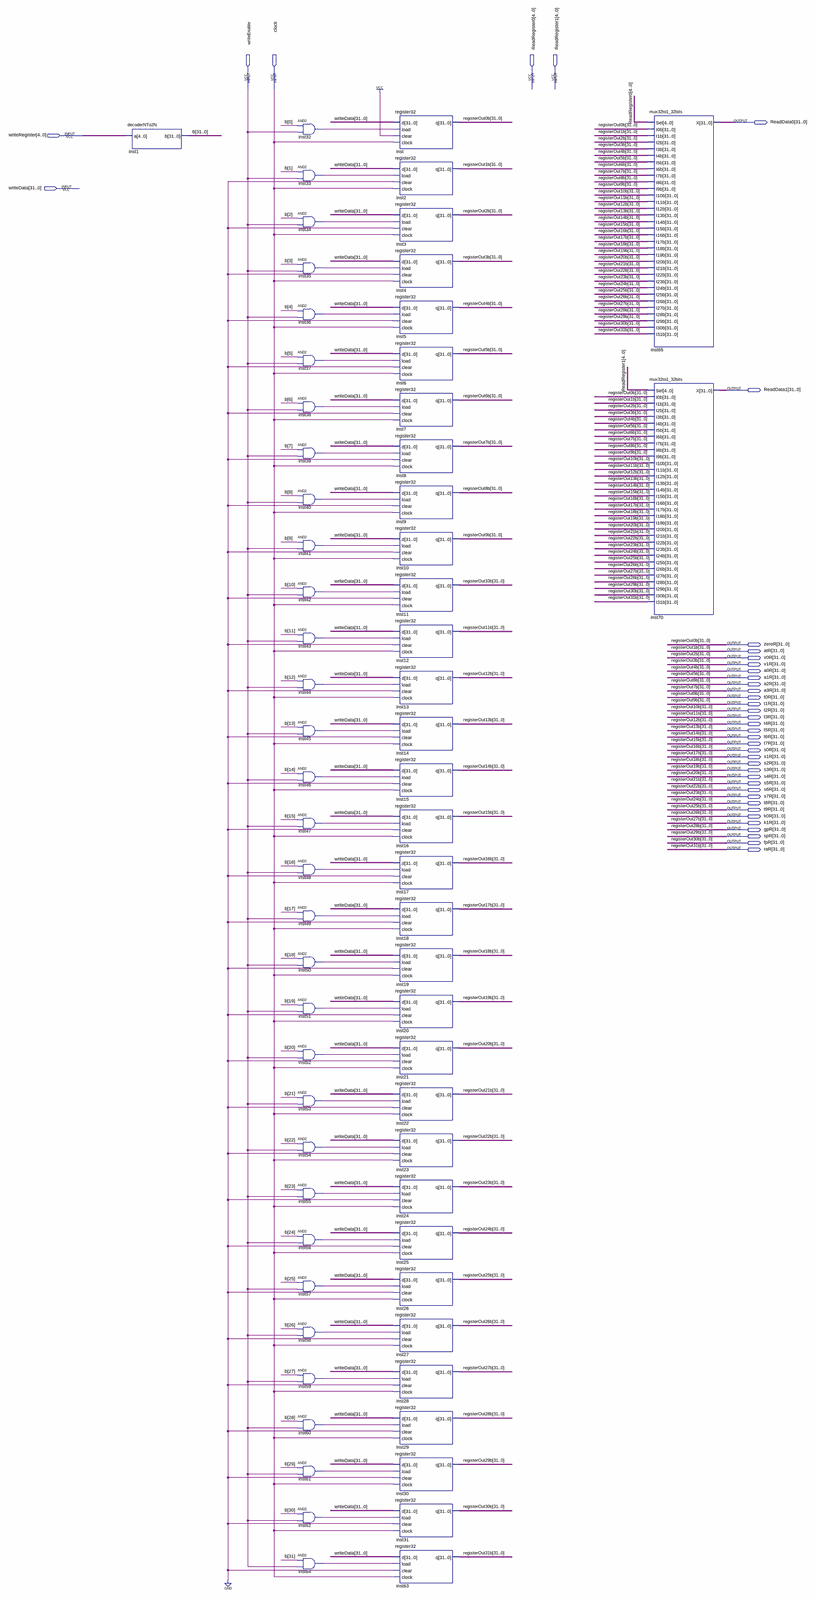
[diagram p0: schematic sheet, whole]
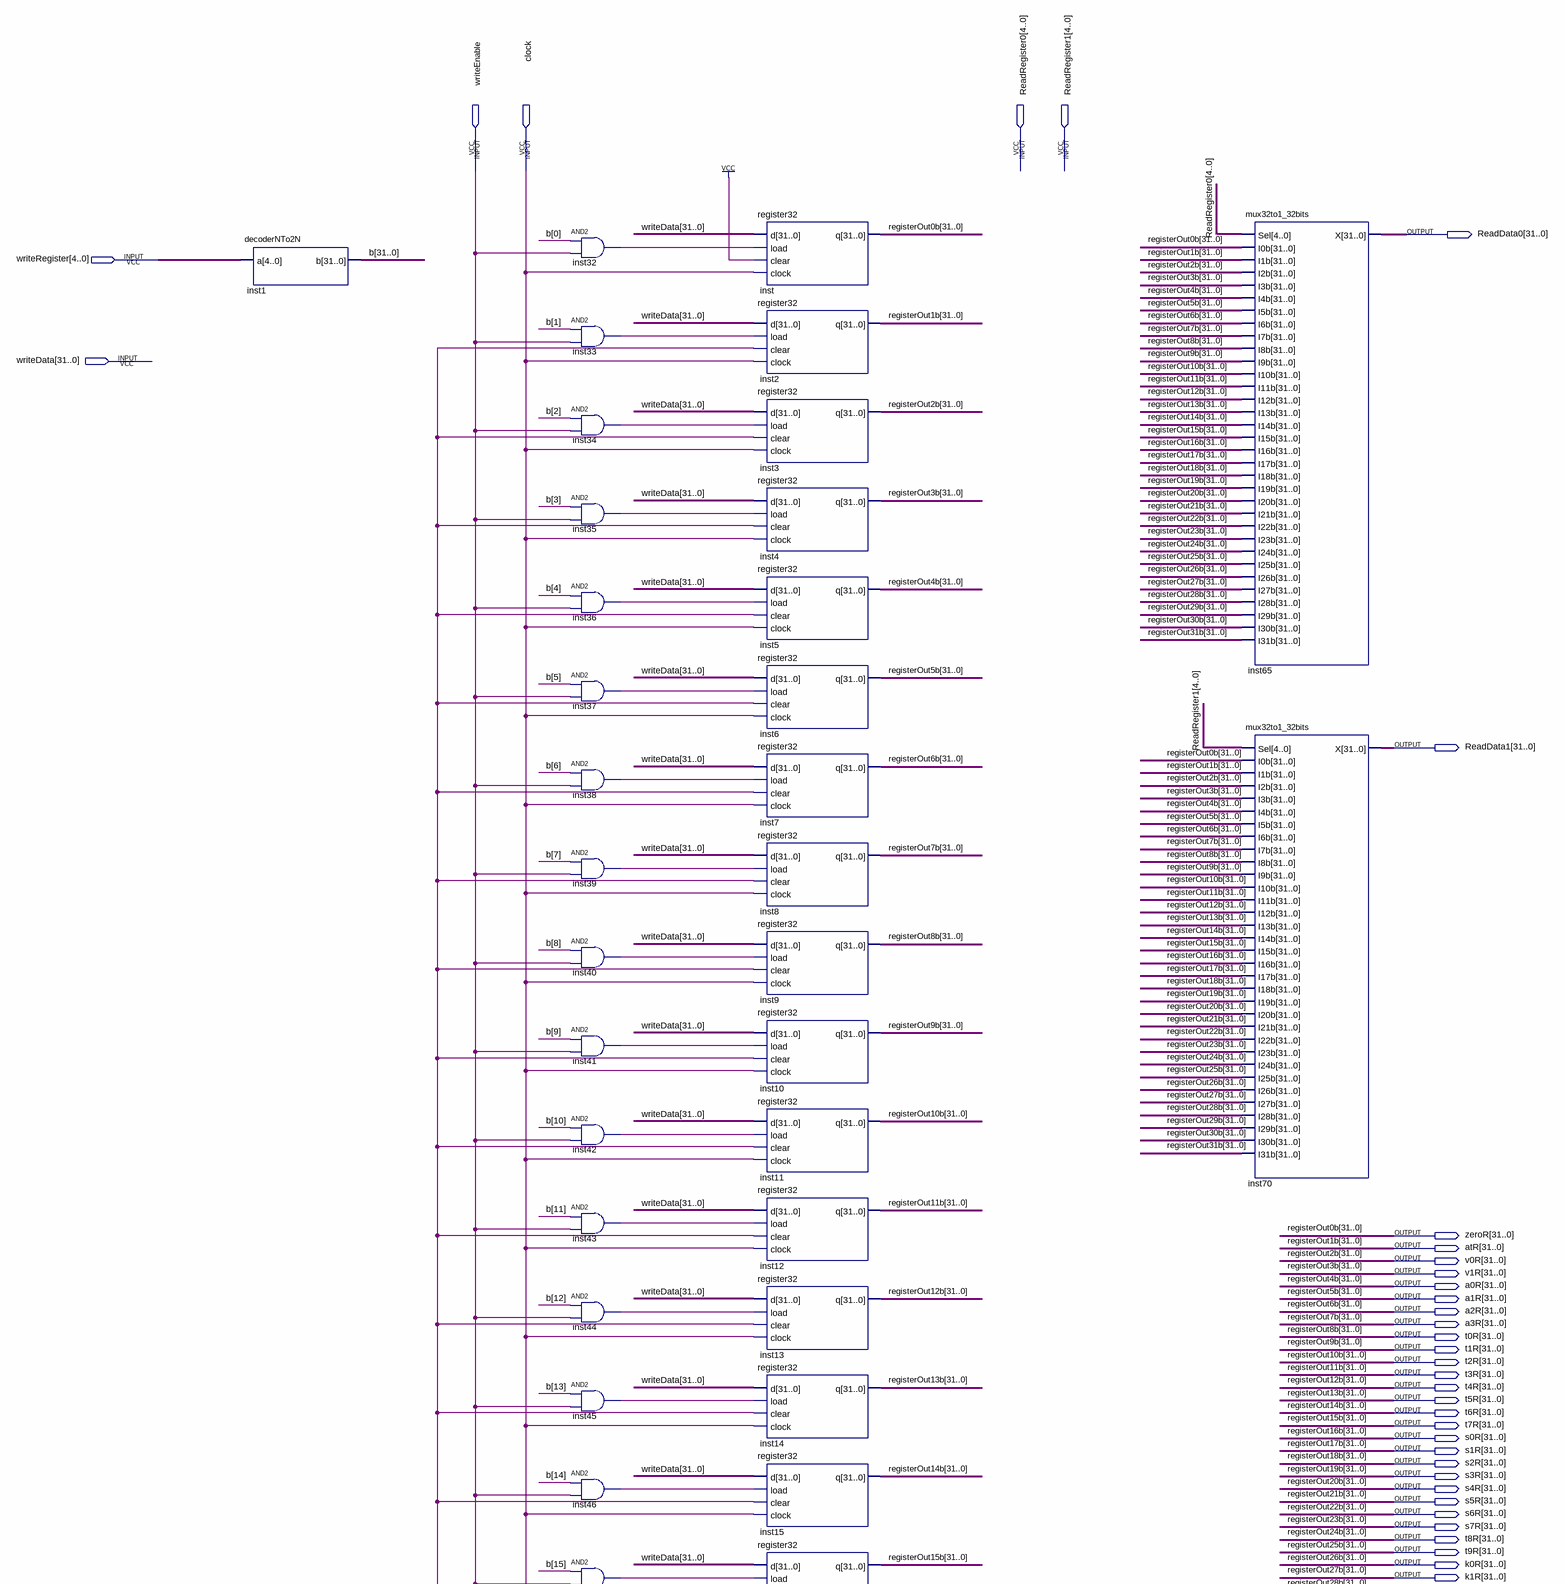
[diagram p1: schematic sheet, upper part]
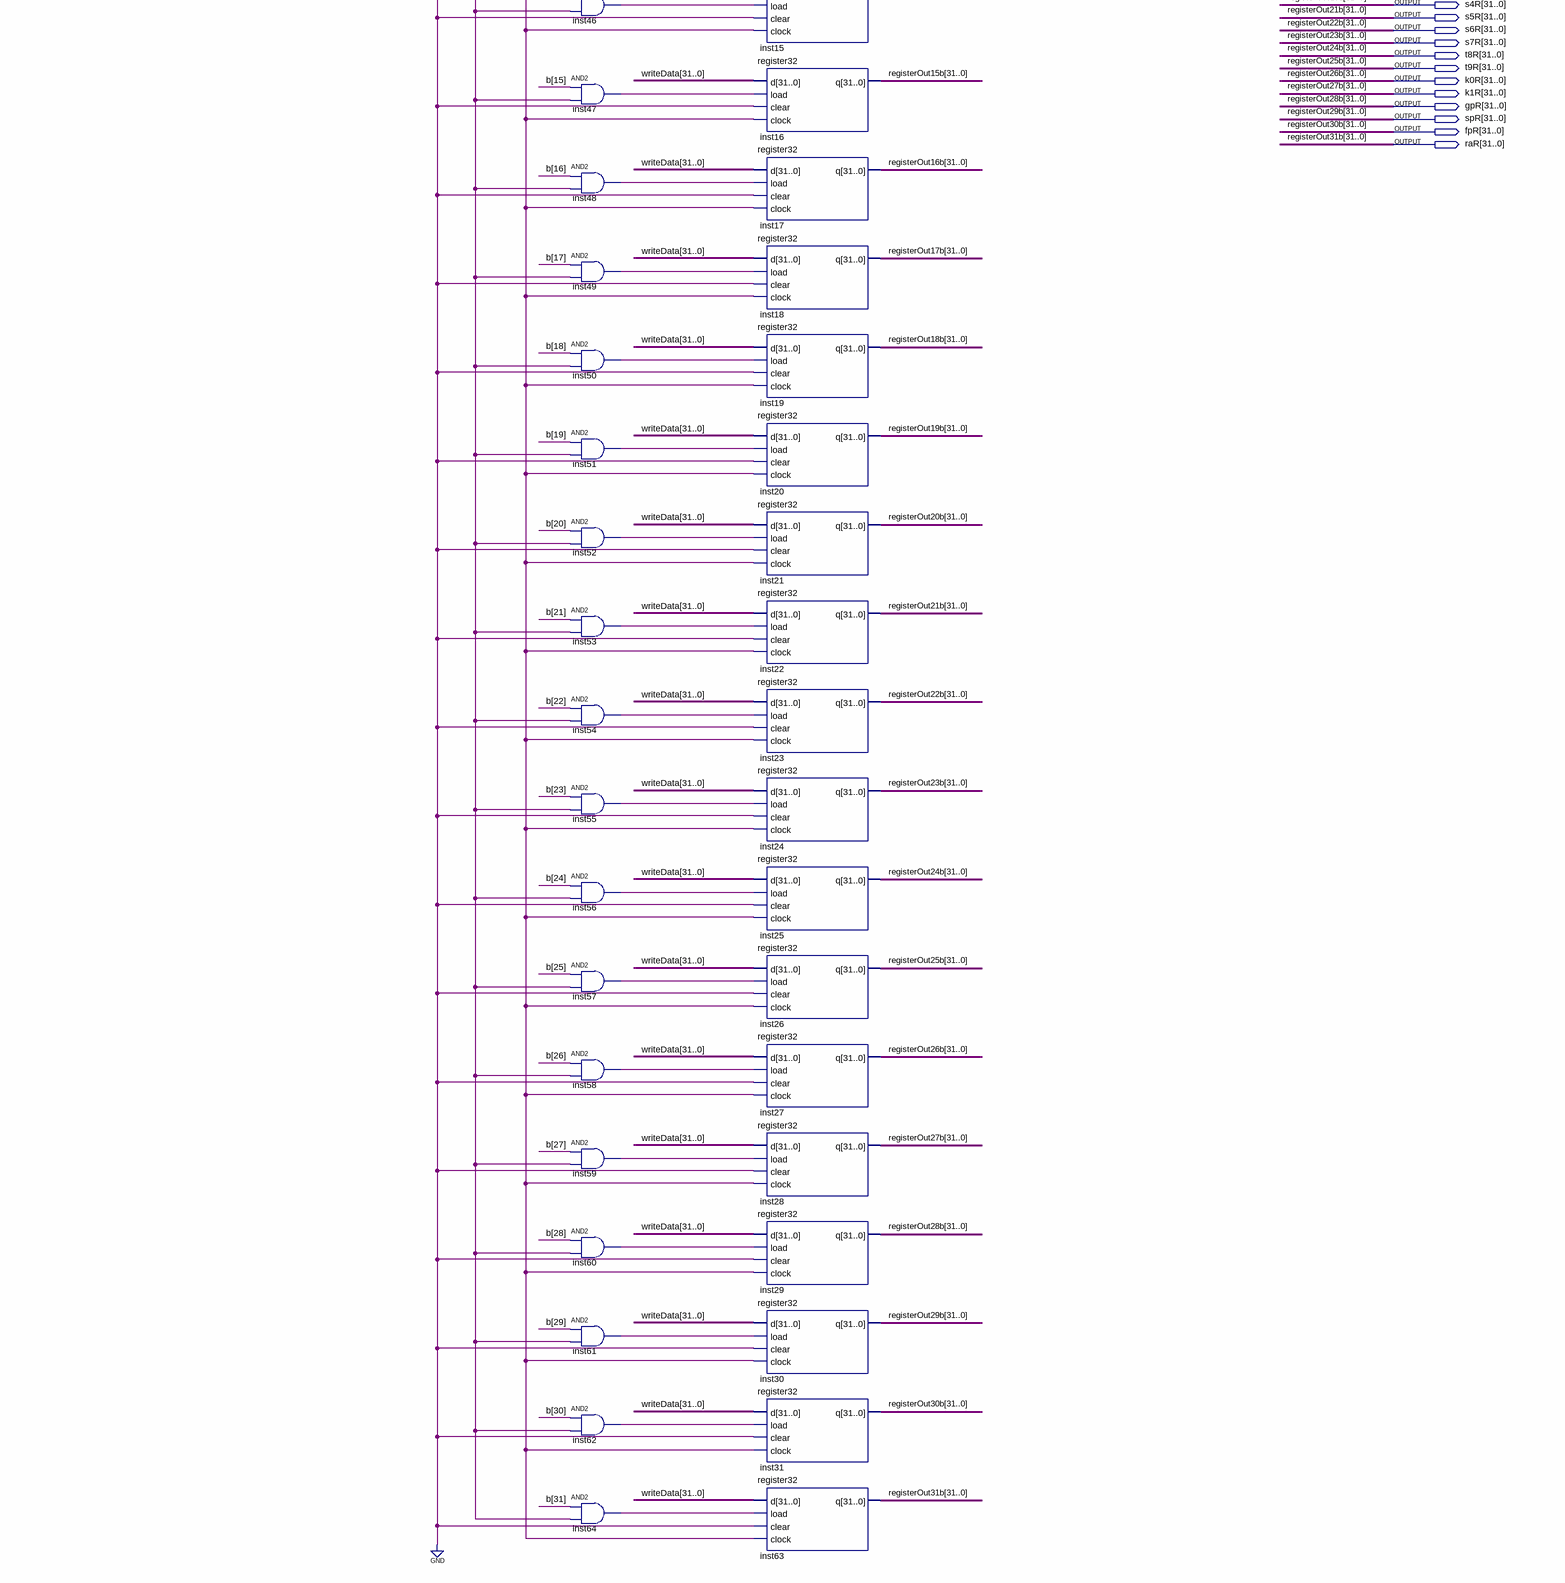
[diagram p2: schematic sheet, lower part]
// Quartus schematic registerBank.bdf as structural Verilog: 67 symbols, 40 pins
module registerBank (
  input  writeEnable,
  input  clock,
  input  [4:0] ReadRegister0,
  input  [4:0] ReadRegister1,
  input  [4:0] writeRegister,
  input  [31:0] writeData,
  output [31:0] ReadData0,
  output [31:0] ReadData1,
  output [31:0] zeroR,
  output [31:0] atR,
  output [31:0] v0R,
  output [31:0] v1R,
  output [31:0] a0R,
  output [31:0] a1R,
  output [31:0] a2R,
  output [31:0] a3R,
  output [31:0] t0R,
  output [31:0] t1R,
  output [31:0] t2R,
  output [31:0] t3R,
  output [31:0] t4R,
  output [31:0] t5R,
  output [31:0] t6R,
  output [31:0] t7R,
  output [31:0] s0R,
  output [31:0] s1R,
  output [31:0] s2R,
  output [31:0] s3R,
  output [31:0] s4R,
  output [31:0] s5R,
  output [31:0] s6R,
  output [31:0] s7R,
  output [31:0] t8R,
  output [31:0] t9R,
  output [31:0] k0R,
  output [31:0] k1R,
  output [31:0] gpR,
  output [31:0] spR,
  output [31:0] fpR,
  output [31:0] raR
);

  wire inst32_out, inst33_out, inst34_out, inst35_out, inst36_out, inst37_out, inst38_out, inst39_out,
       inst40_out, inst41_out, inst42_out, inst43_out, inst44_out, inst45_out, inst46_out, inst47_out,
       inst48_out, inst49_out, inst50_out, inst51_out, inst52_out, inst53_out, inst54_out, inst55_out,
       inst56_out, inst57_out, inst58_out, inst59_out, inst60_out, inst61_out, inst62_out, inst64_out;
  wire [31:0] b;

  decoderNTo2N inst1 (.a(writeRegister), .b(b));
  and inst32 (inst32_out, b[0], writeEnable);
  and inst33 (inst33_out, b[1], writeEnable);
  and inst34 (inst34_out, b[2], writeEnable);
  and inst35 (inst35_out, b[3], writeEnable);
  and inst36 (inst36_out, b[4], writeEnable);
  and inst37 (inst37_out, b[5], writeEnable);
  and inst38 (inst38_out, b[6], writeEnable);
  and inst39 (inst39_out, b[7], writeEnable);
  and inst40 (inst40_out, b[8], writeEnable);
  and inst41 (inst41_out, b[9], writeEnable);
  and inst42 (inst42_out, b[10], writeEnable);
  and inst43 (inst43_out, b[11], writeEnable);
  and inst44 (inst44_out, b[12], writeEnable);
  and inst45 (inst45_out, b[13], writeEnable);
  and inst46 (inst46_out, b[14], writeEnable);
  and inst47 (inst47_out, b[15], writeEnable);
  and inst48 (inst48_out, b[16], writeEnable);
  and inst49 (inst49_out, b[17], writeEnable);
  and inst50 (inst50_out, b[18], writeEnable);
  and inst51 (inst51_out, b[19], writeEnable);
  and inst52 (inst52_out, b[20], writeEnable);
  and inst53 (inst53_out, b[21], writeEnable);
  and inst54 (inst54_out, b[22], writeEnable);
  and inst55 (inst55_out, b[23], writeEnable);
  and inst56 (inst56_out, b[24], writeEnable);
  and inst57 (inst57_out, b[25], writeEnable);
  and inst58 (inst58_out, b[26], writeEnable);
  and inst59 (inst59_out, b[27], writeEnable);
  and inst60 (inst60_out, b[28], writeEnable);
  and inst61 (inst61_out, b[29], writeEnable);
  and inst62 (inst62_out, b[30], writeEnable);
  and inst64 (inst64_out, b[31], writeEnable);
  register32 inst (.d(writeData), .load(inst32_out), .clear(1'b1), .clock(clock), .q(zeroR));
  register32 inst2 (.d(writeData), .load(inst33_out), .clear(1'b0), .clock(clock), .q(atR));
  register32 inst3 (.d(writeData), .load(inst34_out), .clear(1'b0), .clock(clock), .q(v0R));
  register32 inst4 (.d(writeData), .load(inst35_out), .clear(1'b0), .clock(clock), .q(v1R));
  register32 inst5 (.d(writeData), .load(inst36_out), .clear(1'b0), .clock(clock), .q(a0R));
  register32 inst6 (.d(writeData), .load(inst37_out), .clear(1'b0), .clock(clock), .q(a1R));
  register32 inst7 (.d(writeData), .load(inst38_out), .clear(1'b0), .clock(clock), .q(a2R));
  register32 inst8 (.d(writeData), .load(inst39_out), .clear(1'b0), .clock(clock), .q(a3R));
  register32 inst9 (.d(writeData), .load(inst40_out), .clear(1'b0), .clock(clock), .q(t0R));
  register32 inst10 (.d(writeData), .load(inst41_out), .clear(1'b0), .clock(clock), .q(t1R));
  register32 inst11 (.d(writeData), .load(inst42_out), .clear(1'b0), .clock(clock), .q(t2R));
  register32 inst12 (.d(writeData), .load(inst43_out), .clear(1'b0), .clock(clock), .q(t3R));
  register32 inst13 (.d(writeData), .load(inst44_out), .clear(1'b0), .clock(clock), .q(t4R));
  register32 inst14 (.d(writeData), .load(inst45_out), .clear(1'b0), .clock(clock), .q(t5R));
  register32 inst15 (.d(writeData), .load(inst46_out), .clear(1'b0), .clock(clock), .q(t6R));
  register32 inst16 (.d(writeData), .load(inst47_out), .clear(1'b0), .clock(clock), .q(t7R));
  register32 inst17 (.d(writeData), .load(inst48_out), .clear(1'b0), .clock(clock), .q(s0R));
  register32 inst18 (.d(writeData), .load(inst49_out), .clear(1'b0), .clock(clock), .q(s1R));
  register32 inst19 (.d(writeData), .load(inst50_out), .clear(1'b0), .clock(clock), .q(s2R));
  register32 inst20 (.d(writeData), .load(inst51_out), .clear(1'b0), .clock(clock), .q(s3R));
  register32 inst21 (.d(writeData), .load(inst52_out), .clear(1'b0), .clock(clock), .q(s4R));
  register32 inst22 (.d(writeData), .load(inst53_out), .clear(1'b0), .clock(clock), .q(s5R));
  register32 inst23 (.d(writeData), .load(inst54_out), .clear(1'b0), .clock(clock), .q(s6R));
  register32 inst24 (.d(writeData), .load(inst55_out), .clear(1'b0), .clock(clock), .q(s7R));
  register32 inst25 (.d(writeData), .load(inst56_out), .clear(1'b0), .clock(clock), .q(t8R));
  register32 inst26 (.d(writeData), .load(inst57_out), .clear(1'b0), .clock(clock), .q(t9R));
  register32 inst27 (.d(writeData), .load(inst58_out), .clear(1'b0), .clock(clock), .q(k0R));
  register32 inst28 (.d(writeData), .load(inst59_out), .clear(1'b0), .clock(clock), .q(k1R));
  register32 inst29 (.d(writeData), .load(inst60_out), .clear(1'b0), .clock(clock), .q(gpR));
  register32 inst30 (.d(writeData), .load(inst61_out), .clear(1'b0), .clock(clock), .q(spR));
  register32 inst31 (.d(writeData), .load(inst62_out), .clear(1'b0), .clock(clock), .q(fpR));
  register32 inst63 (.d(writeData), .load(inst64_out), .clear(1'b0), .clock(clock), .q(raR));
  mux32to1_32bits inst65 (
    .Sel(ReadRegister0), .I0b(zeroR), .I1b(atR), .I2b(v0R), .I3b(v1R), .I4b(a0R), .I5b(a1R), .I6b(a2R),
    .I7b(a3R), .I8b(t0R), .I9b(t1R), .I10b(t2R), .I11b(t3R), .I12b(t4R), .I13b(t5R), .I14b(t6R), .I15b(t7R),
    .I16b(s0R), .I17b(s1R), .I18b(s2R), .I19b(s3R), .I20b(s4R), .I21b(s5R), .I22b(s6R), .I23b(s7R),
    .I24b(t8R), .I25b(t9R), .I26b(k0R), .I27b(k1R), .I28b(gpR), .I29b(spR), .I30b(fpR), .I31b(raR),
    .X(ReadData0));
  mux32to1_32bits inst70 (
    .Sel(ReadRegister1), .I0b(zeroR), .I1b(atR), .I2b(v0R), .I3b(v1R), .I4b(a0R), .I5b(a1R), .I6b(a2R),
    .I7b(a3R), .I8b(t0R), .I9b(t1R), .I10b(t2R), .I11b(t3R), .I12b(t4R), .I13b(t5R), .I14b(t6R), .I15b(t7R),
    .I16b(s0R), .I17b(s1R), .I18b(s2R), .I19b(s3R), .I20b(s4R), .I21b(s5R), .I22b(s6R), .I23b(s7R),
    .I24b(t8R), .I25b(t9R), .I26b(k0R), .I27b(k1R), .I28b(gpR), .I29b(spR), .I30b(fpR), .I31b(raR),
    .X(ReadData1));

  // Other names for the same wires on the sheet: registerOut0b[31:0] = zeroR; registerOut1b[31:0] = atR;
  //   registerOut2b[31:0] = v0R; registerOut3b[31:0] = v1R; registerOut4b[31:0] = a0R; registerOut5b[31:0] = a1R;
  //   registerOut6b[31:0] = a2R; registerOut7b[31:0] = a3R; registerOut8b[31:0] = t0R; registerOut9b[31:0] = t1R;
  //   registerOut10b[31:0] = t2R; registerOut11b[31:0] = t3R; registerOut12b[31:0] = t4R; registerOut13b[31:0] = t5R;
  //   registerOut14b[31:0] = t6R; registerOut15b[31:0] = t7R; registerOut16b[31:0] = s0R; registerOut17b[31:0] = s1R;
  //   registerOut18b[31:0] = s2R; registerOut19b[31:0] = s3R; registerOut20b[31:0] = s4R; registerOut21b[31:0] = s5R;
  //   registerOut22b[31:0] = s6R; registerOut23b[31:0] = s7R; registerOut24b[31:0] = t8R; registerOut25b[31:0] = t9R;
  //   registerOut26b[31:0] = k0R; registerOut27b[31:0] = k1R; registerOut28b[31:0] = gpR; registerOut29b[31:0] = spR;
  //   registerOut30b[31:0] = fpR; registerOut31b[31:0] = raR
endmodule
